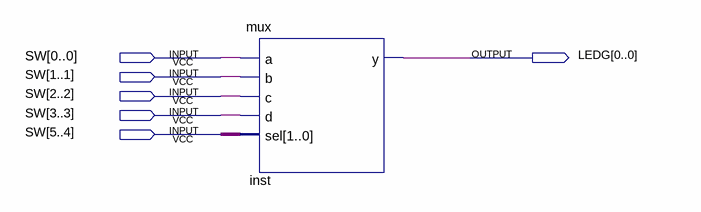
[diagram p0: schematic sheet]
// Quartus schematic mux4_1.bdf as structural Verilog: 1 symbols, 6 pins
module mux4_1 (
  input  [5:0] SW,
  output [0:0] LEDG
);

  mux inst (.a(SW[0]), .b(SW[1]), .c(SW[2]), .d(SW[3]), .sel(SW[5:4]), .y(LEDG[0]));
endmodule
